# Altium schematic sheet schmeatic.SchDoc
size A4; SheetNumber: 2; SheetTotal: 2
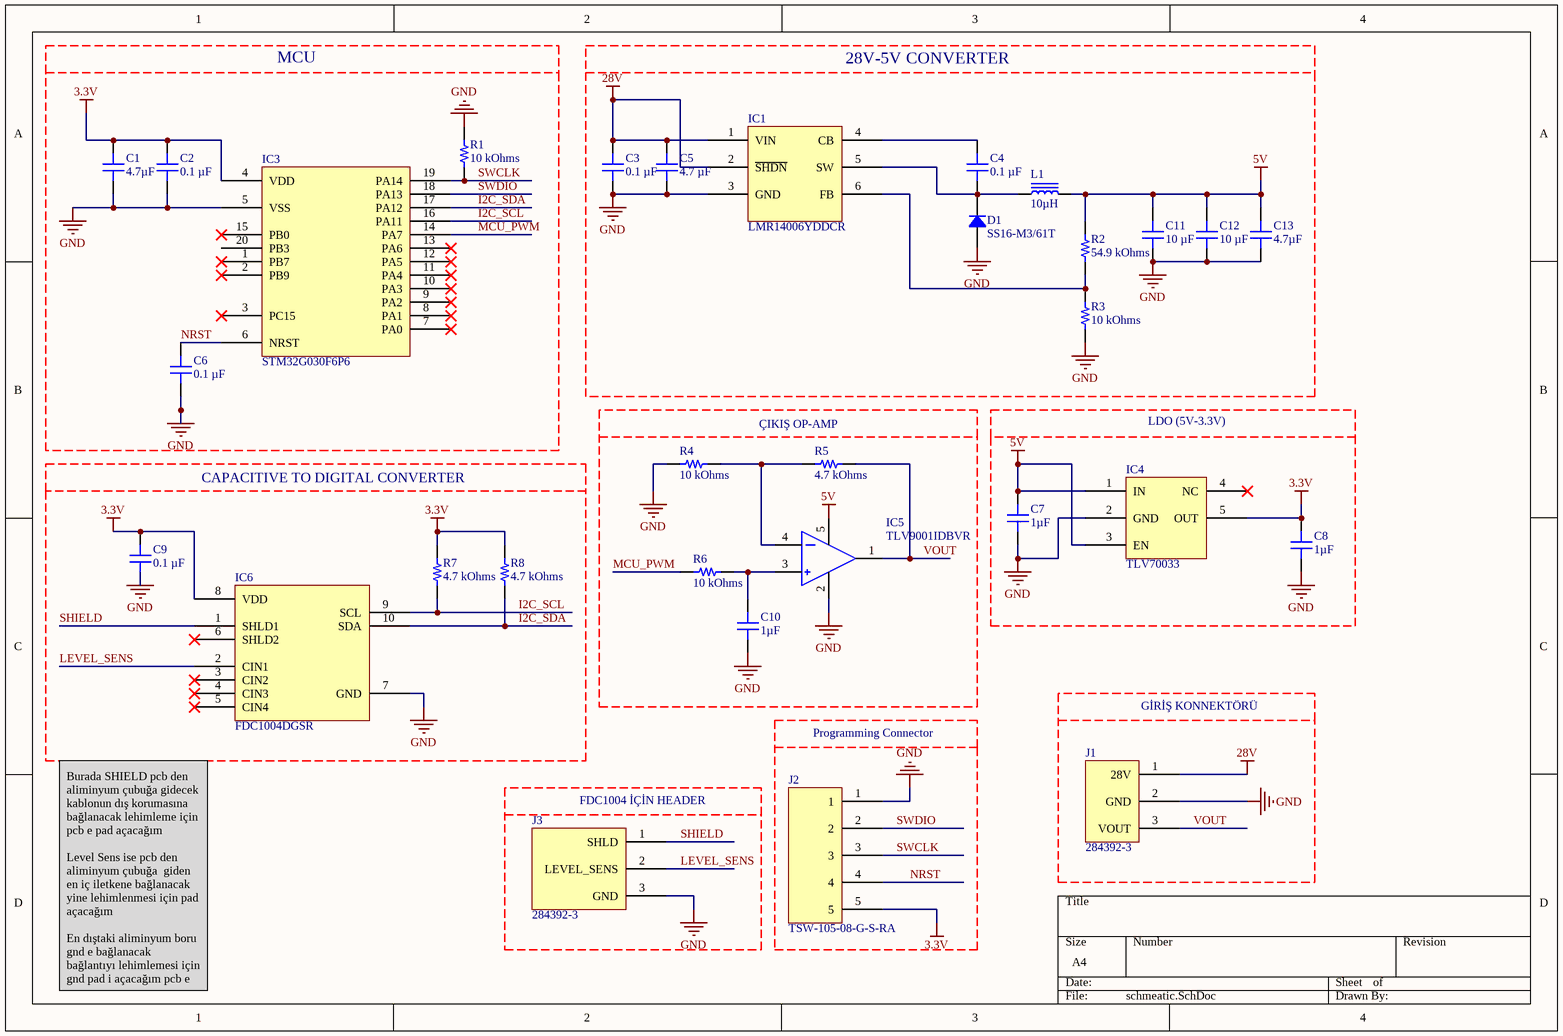
[diagram p0: schmeatic.SchDoc]

## Parts
C1  4.7µF  [CAP 0805_2012]
C2  0.1 µF  [CAP 0805_2012]
C3  0.1 µF  [CAP 0805_2012]
C4  0.1 µF  [CAP 0805_2012]
C5  4.7 µF  [CAP 0805_2012]
C6  0.1 µF  [CAP 0805_2012]
C7  1µF  [CAP 0805_2012]
C8  1µF  [CAP 0805_2012]
C9  0.1 µF  [CAP 0805_2012]
C10  1µF  [CAP 0805_2012]
C11  10 µF  [MURATA GRM21B 0805_2012]
C12  10 µF  [MURATA GRM21B 0805_2012]
C13  4.7µF  [CAP 0805_2012]
D1  SS16-M3/61T  [DO214AC SMA]
IC1  LMR14006YDDCR  [TSOT-23-6]
IC3  STM32G030F6P6  [TSSOP20]
IC4  TLV70033  [SOT23-5]
IC5  TLV9001IDBVR  [SOT23-5]
IC6  FDC1004DGSR  [10-VSSOP (DGS)]
J1  284392-3  [284392-3]
J2  TSW-105-08-G-S-RA  [TSW-105-08-G-S-RA]
J3  284392-3  [284392-3]
L1  10µH  [TDK SLF7032]
R1  10 kOhms  [YAGEO RES 0805_2012]
R2  54.9 kOhms  [RES 0805_2012]
R3  10 kOhms  [YAGEO RES 0805_2012]
R4  10 kOhms  [RES 0805_2012]
R5  4.7 kOhms  [YAGEO RES 0805_2012]
R6  10 kOhms  [RES 0805_2012]
R7  4.7 kOhms  [YAGEO RES 0805_2012]
R8  4.7 kOhms  [YAGEO RES 0805_2012]

## Blocks framed on the sheet
MCU: C1 C2 C6 IC3 R1
LDO (5V-3.3V): C7 C8 IC4
CAPACITIVE TO DIGITAL CONVERTER: C9 IC6 R7 R8

## Nets
3.3V: C1.2 C2.2 C8.1 C9.2 IC3.4(VDD) IC4.5(OUT) IC6.8(VDD) J2.5 R7.2 R8.2
5V: C7.1 C11.2 C12.2 C13.2 IC4.1(IN) IC4.3(EN) IC5.5 L1.2 R2.2
28V: C3.2 C5.2 IC1.1(VIN) IC1.2(~{SHDN}) J1.1(28V)
GND: C1.1 C2.1 C3.1 C5.1 C6.1 C7.2 C8.2 C9.1 C10.2 C11.1 C12.1 C13.1 D1.1 IC1.3(GND) IC3.5(VSS) IC4.2(GND) IC5.2 IC6.7(GND) J1.2(GND) J2.1 J3.3(GND) R1.2 R3.1 R4.1
I2C_SCL: IC3.16(PA11) IC6.9(SCL) R7.1
I2C_SDA: IC3.17(PA12) IC6.10(SDA) R8.1
LEVEL_SENS: IC6.2(CIN1) J3.2(LEVEL_SENS)
MCU_PWM: IC3.14(PA7) R6.1
NRST: C6.2 IC3.6(NRST) J2.4
SHIELD: IC6.1(SHLD1) J3.1(SHLD)
SWCLK: IC3.19(PA14) J2.3 R1.1
SWDIO: IC3.18(PA13) J2.2
VOUT: IC5.1 J1.3(VOUT) R5.2
NetC4_1: C4.1 D1.2 IC1.5(SW) L1.1
NetC4_2: C4.2 IC1.4(CB)
NetC10_1: C10.1 IC5.3 R6.2
NetIC1_6: IC1.6(FB) R2.1 R3.2
NetIC5_4: IC5.4 R4.2 R5.1

Not connected (* = marked no-connect by the designer): IC3 1(PB7)* 2(PB9)* 3(PC15)* 7(PA0)* 8(PA1)* 9(PA2)* 10(PA3)* 11(PA4)* 12(PA5)* 13(PA6)* 15(PB0)* 20(PB3); IC4 4(NC)*; IC6 3(CIN2)* 4(CIN3)* 5(CIN4)* 6(SHLD2)*

## Notes on the sheet
- 28V-5V CONVERTER
- (near R5) ÇIKIŞ OP-AMP
- GİRİŞ KONNEKTÖRÜ
- Programming Connector
- (near J3) FDC1004 İÇİN HEADER
- Burada SHIELD pcb den aliminyum çubuğa gidecek kablonun dış korumasına bağlanacak lehimleme için pcb e pad açacağım
  Level Sens ise pcb den aliminyum çubuğa  giden en iç iletkene bağlanacak yine lehimlenmesi için pad açacağım
  En dıştaki aliminyum boru gnd e bağlanacak bağlantıyı lehimlemesi için gnd pad i açacağım pcb e

## Library data of the parts
C1 = 0805YC475MAT2A: CAP CER 4.7UF 16V X7R 0805; manufacturer: AVX Corporation; Tolerance: ±20%; Part Number: 0805YC475MAT2A; Capacitance: 4.7µF; Applications: General Purpose; componentlink1description: Datasheet; componentlink1url: http://datasheets.avx.com/X7RDielectric.pdf; componentlink2description: DigiKey Link; componentlink2url: http://digikey.com/product-detail/en/avx-corporation/0805YC475MAT2A/478-10575-1-ND/6797621; Device Package: 0805 (2012 Metric); lastupdated: 2.09.2020 01:04:40; Lifecycle Status: Active; Minimum Order: 1; Mounting Type: Surface Mount, MLCC; Operating Temperature: -55°C ~ 125°C; Package / Case: 0805 (2012 Metric); packaging: TapeAndReel; partid: 3443; Part Status: Active; price: 0.12; series: -; Size / Dimension: 0.079" L x 0.049" W (2.01mm x 1.25mm); Supplier 1: DigiKey; Supplier Part Number 1: 478-10575-1-ND; Temperature Coefficient: X7R; Thickness (Max): 0.060" (1.52mm); value: 4.7µF; Voltage - Rated: 16V
C2 C6 C9 = 160R15W104KV4T: CAP CER 0.1UF 16V X7R 0805; manufacturer: Johanson Dielectrics Inc.; Tolerance: ±10%; Part Number: 160R15W104KV4T; Capacitance: 0.1 µF; Applications: General Purpose; componentlink1description: Datasheet; componentlink1url: https://www.johansondielectrics.com/downloads/catalog/johanson-dielectrics-product-catalog.pdf; componentlink2description: DigiKey Link; componentlink2url: https://www.digikey.com/en/products/detail/johanson-dielectrics-inc/160R15W104KV4T/1859428; Device Package: 0805 (2012 Metric); lastupdated: 9.02.2024 20:15:52; Lifecycle Status: Active; Minimum Order: 1; Mounting Type: Surface Mount, MLCC; Operating Temperature: -55°C ~ 125°C; Package / Case: 0805 (2012 Metric); packaging: TapeAndReel; partid: 9125; Part Status: Active; price: 0.03; series: -; Size / Dimension: 0.080" L x 0.050" W (2.03mm x 1.27mm); Supplier 1: DigiKey; Supplier Part Number 1: 709-1183-1-ND; Temperature Coefficient: X7R; Thickness (Max): 0.050" (1.27mm); value: 0.1 µF; Voltage - Rated: 16V
C3 = 885012207098: CAP CER 0.1UF 50V X7R 0805; manufacturer: Würth Elektronik; Tolerance: ±10%; Part Number: 885012207098; Capacitance: 0.1 µF; Applications: General Purpose; componentlink1description: Datasheet; componentlink1url: https://katalog.we-online.de/pbs/datasheet/885012207098.pdf; componentlink2description: DigiKey Link; componentlink2url: https://www.digikey.com/en/products/detail/würth-elektronik/885012207098/5453935; Device Package: 0805 (2012 Metric); lastupdated: 9.02.2024 20:15:51; Lifecycle Status: Active; Minimum Order: 1; Mounting Type: Surface Mount, MLCC; Operating Temperature: -55°C ~ 125°C; Package / Case: 0805 (2012 Metric); packaging: TapeAndReel; partid: 9164; Part Status: Active; price: 0.03; series: WCAP-CSGP; Size / Dimension: 0.079" L x 0.049" W (2.00mm x 1.25mm); Supplier 1: DigiKey; Supplier Part Number 1: 732-8080-1-ND; Temperature Coefficient: X7R; Thickness (Max): 0.035" (0.90mm); value: 0.1 µF; Voltage - Rated: 50V
C4 = 0805Y0250104KXT: CAP CER 0.1UF 25V X7R 0805; manufacturer: Knowles Syfer; Tolerance: ±10%; Part Number: 0805Y0250104KXT; Capacitance: 0.1 µF; Applications: Boardflex Sensitive; componentlink1description: Datasheet; componentlink1url: https://www.knowlescapacitors.com/getattachment/2dbfc8bc-e2b3-4b4d-afb1-43b011b9ebe0/High-Std-Voltage.aspx; componentlink2description: DigiKey Link; componentlink2url: https://www.digikey.com/en/products/detail/knowles-syfer/0805Y0250104KXT/5729991; Device Package: 0805 (2012 Metric); Features: Soft Termination; lastupdated: 9.02.2024 20:16:06; Lifecycle Status: Active; Minimum Order: 1; Mounting Type: Surface Mount, MLCC; Operating Temperature: -55°C ~ 125°C; Package / Case: 0805 (2012 Metric); packaging: TapeAndReel; partid: 3471; Part Status: Active; price: 0.15; series: FlexiCap™; Size / Dimension: 0.079" L x 0.049" W (2.00mm x 1.25mm); Supplier 1: DigiKey; Supplier Part Number 1: 1608-1010-1-ND; Temperature Coefficient: X7R; Thickness (Max): 0.051" (1.30mm); value: 0.1 µF; Voltage - Rated: 25V
C5 = CGA4J1X7R1H475K125AE: CAP CER 4.7UF 50V X7R 0805; manufacturer: TDK Corporation; Tolerance: ±10%; Part Number: CGA4J1X7R1H475K125AE; Capacitance: 4.7 µF; Applications: Automotive, Boardflex Sensitive; componentlink1description: Datasheet; componentlink1url: https://product.tdk.com/info/en/catalog/datasheets/mlcc_automotive_soft_en.pdf?ref_disty=digikey; componentlink2description: DigiKey Link; componentlink2url: https://www.digikey.com/en/products/detail/tdk-corporation/CGA4J1X7R1H475K125AE/9744776; Device Package: 0805 (2012 Metric); Features: Soft Termination; lastupdated: 9.02.2024 20:15:46; Lifecycle Status: Active; Minimum Order: 1; Mounting Type: Surface Mount, MLCC; Operating Temperature: -55°C ~ 125°C; Package / Case: 0805 (2012 Metric); packaging: TapeAndReel; partid: 39626; Part Status: Active; price: 0.15; Ratings: AEC-Q200; series: CGA; Size / Dimension: 0.079" L x 0.049" W (2.00mm x 1.25mm); Supplier 1: DigiKey; Supplier Part Number 1: 445-181410-1-ND; Temperature Coefficient: X7R; Thickness (Max): 0.059" (1.50mm); value: 4.7 µF; Voltage - Rated: 50V
C7 C8 C10 = 0805YC105KAT4A: CAP CER 1UF 16V X7R 0805; manufacturer: AVX Corporation; Tolerance: ±10%; Part Number: 0805YC105KAT4A; Capacitance: 1µF; Applications: General Purpose; componentlink1description: Datasheet; componentlink1url: http://datasheets.avx.com/X7RDielectric.pdf; componentlink2description: DigiKey Link; componentlink2url: http://digikey.com/product-detail/en/avx-corporation/0805YC105KAT4A/478-11534-1-ND/8108826; Device Package: 0805 (2012 Metric); lastupdated: 2.09.2020 01:04:40; Lifecycle Status: Active; Minimum Order: 1; Mounting Type: Surface Mount, MLCC; Operating Temperature: -55°C ~ 125°C; Package / Case: 0805 (2012 Metric); packaging: TapeAndReel; partid: 3647; Part Status: Active; price: 0.04; series: -; Size / Dimension: 0.079" L x 0.049" W (2.01mm x 1.25mm); Supplier 1: DigiKey; Supplier Part Number 1: 478-11534-1-ND; Temperature Coefficient: X7R; Thickness (Max): 0.055" (1.40mm); value: 1µF; Voltage - Rated: 16V
C11 C12 = GRM21BZ71E106KE15L: CAP CER 10UF 25V X7R 0805; manufacturer: Murata Electronics; Tolerance: ±10%; Part Number: GRM21BZ71E106KE15L; Capacitance: 10 µF; Applications: General Purpose; componentlink1description: Datasheet; componentlink1url: https://search.murata.co.jp/Ceramy/image/img/A01X/G101/ENG/GRM21BZ71E106KE15-01.pdf; componentlink2description: DigiKey Link; componentlink2url: https://www.digikey.com/en/products/detail/murata-electronics/GRM21BZ71E106KE15L/13904911; Device Package: 0805 (2012 Metric); lastupdated: 27.08.2024 09:29:54; Lifecycle Status: Active; Minimum Order: 1; Mounting Type: Surface Mount, MLCC; Operating Temperature: -55°C ~ 125°C; Package / Case: 0805 (2012 Metric); packaging: TapeAndReel; partid: 47278; Part Status: Active; price: 0.05; series: GRM; Size / Dimension: 0.079" L x 0.049" W (2.00mm x 1.25mm); Supplier 1: DigiKey; Supplier Part Number 1: 490-GRM21BZ71E106KE15LCT-ND; Temperature Coefficient: X7R; Thickness (Max): 0.057" (1.45mm); value: 10 µF; Voltage - Rated: 25V
C13 = 08053C475MAT2A: CAP CER 4.7UF 25V X7R 0805; manufacturer: AVX Corporation; Tolerance: ±20%; Part Number: 08053C475MAT2A; Capacitance: 4.7µF; Applications: General Purpose; componentlink1description: Datasheet; componentlink1url: http://datasheets.avx.com/X7RDielectric.pdf; componentlink2description: DigiKey Link; componentlink2url: http://digikey.com/product-detail/en/avx-corporation/08053C475MAT2A/478-12472-1-ND/9749324; Device Package: 0805 (2012 Metric); lastupdated: 2.09.2020 01:04:10; Lifecycle Status: Active; Minimum Order: 1; Mounting Type: Surface Mount, MLCC; Operating Temperature: -55°C ~ 125°C; Package / Case: 0805 (2012 Metric); packaging: TapeAndReel; partid: 17332; Part Status: Active; price: 0.12; series: -; Size / Dimension: 0.079" L x 0.049" W (2.01mm x 1.25mm); Supplier 1: DigiKey; Supplier Part Number 1: 478-12472-1-ND; Temperature Coefficient: X7R; Thickness (Max): 0.060" (1.52mm); value: 4.7µF; Voltage - Rated: 25V
D1 = SS16-M3/61T: DIODE SCHOTTKY 1A 60V DO-214AC; Manufacturer: Vishay Semiconductor Diodes Division; Current - Reverse Leakage @ Vr: 200µA @ 60V; Speed: Fast Recovery =< 500ns, > 200mA (Io); Voltage - Forward (Vf) (Max) @ If: 750mV @ 1A; Part Number: SS16-M3/61T; ComponentLink1Description: Datasheet; ComponentLink1URL: //media.digikey.com/pdf/Data%20Sheets/Vishay%20Semiconductors/SS12-SS16.pdf; ComponentLink2Description: DigiKey Link; ComponentLink2URL: http://digikey.com/product-detail/en/vishay-semiconductor-diodes-division/SS16-M3-61T/SS16-M3-61TGICT-ND/9601211; Current - Average Rectified (Io): 1A; Diode Type: Schottky; LastUpdated: 3.06.2024 19:54:33; Lifecycle Status: Active; Minimum Order: 1; Mounting Type: Surface Mount; Operating Temperature - Junction: -65°C ~ 150°C; Package / Case: DO-214AC, SMA; Packaging: TapeAndReel; PartId: 1996; Part Status: Active; Price: 0.12; Series: -; Supplier 1: DigiKey; Supplier Part Number 1: SS16-M3/61TGICT-ND; Supplier Device Package: DO-214AC (SMA); Voltage - DC Reverse (Vr) (Max): 60V
IC1 = LMR14006YDDCR: Buck Switching Regulator IC Positive Adjustable 0.765V 1 Output 600mA SOT-23-6 Thin, TSOT-23-6
IC3 = STM32G030F6P6: ARM® Cortex®-M0+ STM32G0 Microcontroller IC 32-Bit 64MHz 32KB (32K x 8) FLASH 20-TSSOP
IC4 = TLV70033: Linear Voltage Regulator IC Positive Fixed 1 Output 200mA SC-70-5
IC5 = TLV9001IDBVR: CMOS Amplifier 1 Circuit Rail-to-Rail SOT-23-5
IC6 = FDC1004DGSR: Capacitive Touch Proximity Only 10-VSSOP
J1 = 284392-3: 3 Position Wire to Board Terminal Block Horizontal with Board 0.150" (3.81mm) Through Hole
J2 = TSW-105-08-G-S-RA: Connector Header Through Hole, Right Angle 5 position 0.100" (2.54mm)
J3 = 284392-3 (FDC1004 İÇİN): 3 Position Wire to Board Terminal Block Horizontal with Board 0.150" (3.81mm) Through Hole
L1 = SLF7032T-100M1R4-2PF: FIXED IND 10UH 1.4A 63.6 MOHM; Manufacturer: TDK Corporation; DC Resistance (DCR): 63.6mOhm Max; Inductance Frequency - Test: 100kHz; Material - Core: Ferrite; Shielding: Shielded; Tolerance: ±20%; Type: Wirewound; Part Number: SLF7032T-100M1R4-2PF; ComponentLink1Description: Datasheet; ComponentLink1URL: //media.digikey.com/pdf/Data%20Sheets/TDK%20PDFs/SLF7032_Type.pdf; ComponentLink2Description: DigiKey Link; ComponentLink2URL: http://digikey.com/product-detail/en/tdk-corporation/SLF7032T-100M1R4-2PF/445-1998-1-ND/755405; Current Rating (Amps): 1.4A; Device Package: Nonstandard; Height - Seated (Max): 0.134" (3.40mm); Inductance: 10µH; LastUpdated: 2.09.2020 01:30:24; Lifecycle Status: Active; Minimum Order: 1; Mounting Type: Surface Mount; Operating Temperature: -40°C ~ 105°C; Package / Case: Nonstandard; Packaging: TapeAndReel; PartId: 3677; Part Status: Active; Price: 0.43; Series: SLF; Size / Dimension: 0.276" L x 0.276" W (7.00mm x 7.00mm); Supplier 1: DigiKey; Supplier Part Number 1: 445-1998-1-ND; Value: 10µH
R1 = RV0805FR-0710KL: RES 10K OHM 1% 1/8W 0805; Manufacturer: Yageo; Power (Watts): 0.125W, 1/8W; Temperature Coefficient: ±200ppm/°C; Part Number: RV0805FR-0710KL; Value: 10 kOhms; ComponentLink1Description: Datasheet; ComponentLink1URL: https://www.yageo.com/upload/media/product/productsearch/datasheet/rchip/PYu-RV_51_RoHS_L_12.pdf; ComponentLink2Description: DigiKey Link; ComponentLink2URL: https://www.digikey.com/en/products/detail/yageo/RV0805FR-0710KL/17021062; Composition: Thick Film; Device Package: 0805 (2012 Metric); Features: Automotive AEC-Q200, High Voltage, Moisture Resistant; Height - Seated (Max): 0.024" (0.60mm); LastUpdated: 25.07.2024 09:19:57; Lifecycle Status: Active; Minimum Order: 1; Number of Terminations: 2; Operating Temperature: -55°C ~ 155°C; Package / Case: 0805 (2012 Metric); Packaging: TapeAndReel; PartId: 87554; Price: 0.05; Ratings: AEC-Q200; Resistance: 10 kOhms; Series: RV; Size / Dimension: 0.079" L x 0.049" W (2.00mm x 1.25mm); Supplier 1: DigiKey; Supplier Part Number 1: 13-RV0805FR-0710KLCT-ND; Supplier Device Package: 0805; Tolerance: ±1%
R2 = CRCW080554K9FKEA: RES SMD 54.9K OHM 1% 1/8W 0805; Manufacturer: Vishay Dale; Power (Watts): 0.125W, 1/8W; Temperature Coefficient: ±100ppm/°C; Part Number: CRCW080554K9FKEA; Value: 54.9 kOhms; ComponentLink1Description: Datasheet; ComponentLink1URL: http://www.vishay.com/docs/20035/dcrcwe3.pdf; ComponentLink2Description: DigiKey Link; ComponentLink2URL: https://www.digikey.com/en/products/detail/vishay-dale/CRCW080554K9FKEA/1175835; Composition: Thick Film; Device Package: 0805 (2012 Metric); Features: Automotive AEC-Q200; Height - Seated (Max): 0.020" (0.50mm); LastUpdated: 8.02.2024 21:02:25; Lifecycle Status: Active; Minimum Order: 1; Number of Terminations: 2; Operating Temperature: -55°C ~ 155°C; Package / Case: 0805 (2012 Metric); Packaging: TapeAndReel; PartId: 30745; Part Status: Active; Price: 0.01; Ratings: AEC-Q200; Resistance: 54.9 kOhms; Series: CRCW; Size / Dimension: 0.079" L x 0.049" W (2.00mm x 1.25mm); Supplier 1: DigiKey; Supplier Part Number 1: 541-54.9KCCT-ND; Supplier Device Package: 0805; Tolerance: ±1%
R3 = RT0805FRE0710KL: RES SMD 10K OHM 1% 1/8W 0805; Manufacturer: Yageo; Power (Watts): 0.125W, 1/8W; Temperature Coefficient: ±50ppm/°C; Part Number: RT0805FRE0710KL; Value: 10 kOhms; ComponentLink1Description: Datasheet; ComponentLink1URL: https://www.yageo.com/upload/media/product/productsearch/datasheet/rchip/PYu-RT_1-to-0.01_RoHS_L_11.pdf; ComponentLink2Description: DigiKey Link; ComponentLink2URL: https://www.digikey.com/en/products/detail/yageo/RT0805FRE0710KL/1078908; Composition: Thin Film; Device Package: 0805 (2012 Metric); Height - Seated (Max): 0.024" (0.60mm); LastUpdated: 25.07.2024 09:20:25; Lifecycle Status: Active; Minimum Order: 1; Number of Terminations: 2; Operating Temperature: -55°C ~ 155°C; Package / Case: 0805 (2012 Metric); Packaging: TapeAndReel; PartId: 32332; Part Status: Active; Price: 0.01; Resistance: 10 kOhms; Series: RT; Size / Dimension: 0.079" L x 0.049" W (2.00mm x 1.25mm); Supplier 1: DigiKey; Supplier Part Number 1: YAG1239CT-ND; Supplier Device Package: 0805; Tolerance: ±1%
R4 R6 = CRCW080510K0FKEA: RES SMD 10K OHM 1% 1/8W 0805; Manufacturer: Vishay Dale; Power (Watts): 0.125W, 1/8W; Temperature Coefficient: ±100ppm/°C; Part Number: CRCW080510K0FKEA; Value: 10 kOhms; ComponentLink1Description: Datasheet; ComponentLink1URL: http://www.vishay.com/docs/20035/dcrcwe3.pdf; ComponentLink2Description: DigiKey Link; ComponentLink2URL: https://www.digikey.com/en/products/detail/vishay-dale/CRCW080510K0FKEA/1175751; Composition: Thick Film; Device Package: 0805 (2012 Metric); Features: Automotive AEC-Q200; Height - Seated (Max): 0.020" (0.50mm); LastUpdated: 8.02.2024 21:02:37; Lifecycle Status: Active; Minimum Order: 1; Number of Terminations: 2; Operating Temperature: -55°C ~ 155°C; Package / Case: 0805 (2012 Metric); Packaging: TapeAndReel; PartId: 28101; Part Status: Active; Price: 0.01; Ratings: AEC-Q200; Resistance: 10 kOhms; Series: CRCW; Size / Dimension: 0.079" L x 0.049" W (2.00mm x 1.25mm); Supplier 1: DigiKey; Supplier Part Number 1: 541-10.0KCCT-ND; Supplier Device Package: 0805; Tolerance: ±1%
R5 R7 R8 = RC0805FR-074K7P: RES 4.7K OHM 1% 1/8W 0805; Manufacturer: Yageo; Power (Watts): 0.125W, 1/8W; Ratings: 7C1 RoHS w/out Exemption (100% Pb-Free); Temperature Coefficient: ±100ppm/°C; Part Number: RC0805FR-074K7P; Value: 4.7 kOhms; ComponentLink1Description: Datasheet; ComponentLink1URL: http://www.yageo.com/NewPortal/yageodocoutput?fileName=/pdf/R-Chip/PYu-RC_51_RoHS_P_0.pdf; ComponentLink2Description: DigiKey Link; ComponentLink2URL: https://www.digikey.com/en/products/detail/yageo/RC0805FR-074K7P/4935340; Composition: Thick Film; Device Package: 0805 (2012 Metric); Features: Moisture Resistant; Height - Seated (Max): 0.024" (0.60mm); LastUpdated: 25.07.2024 09:20:26; Lifecycle Status: Active; Minimum Order: 1; Number of Terminations: 2; Operating Temperature: -55°C ~ 155°C; Package / Case: 0805 (2012 Metric); Packaging: TapeAndReel; PartId: 27895; Part Status: Active; Price: 0.01; Resistance: 4.7 kOhms; Series: RC_P; Size / Dimension: 0.079" L x 0.049" W (2.00mm x 1.25mm); Supplier 1: DigiKey; Supplier Part Number 1: YAG1325CT-ND; Supplier Device Package: 0805; Tolerance: ±1%